# EAGLE design stm32f4-discovery-breakout-v2 (EAGLE 6.6.0)
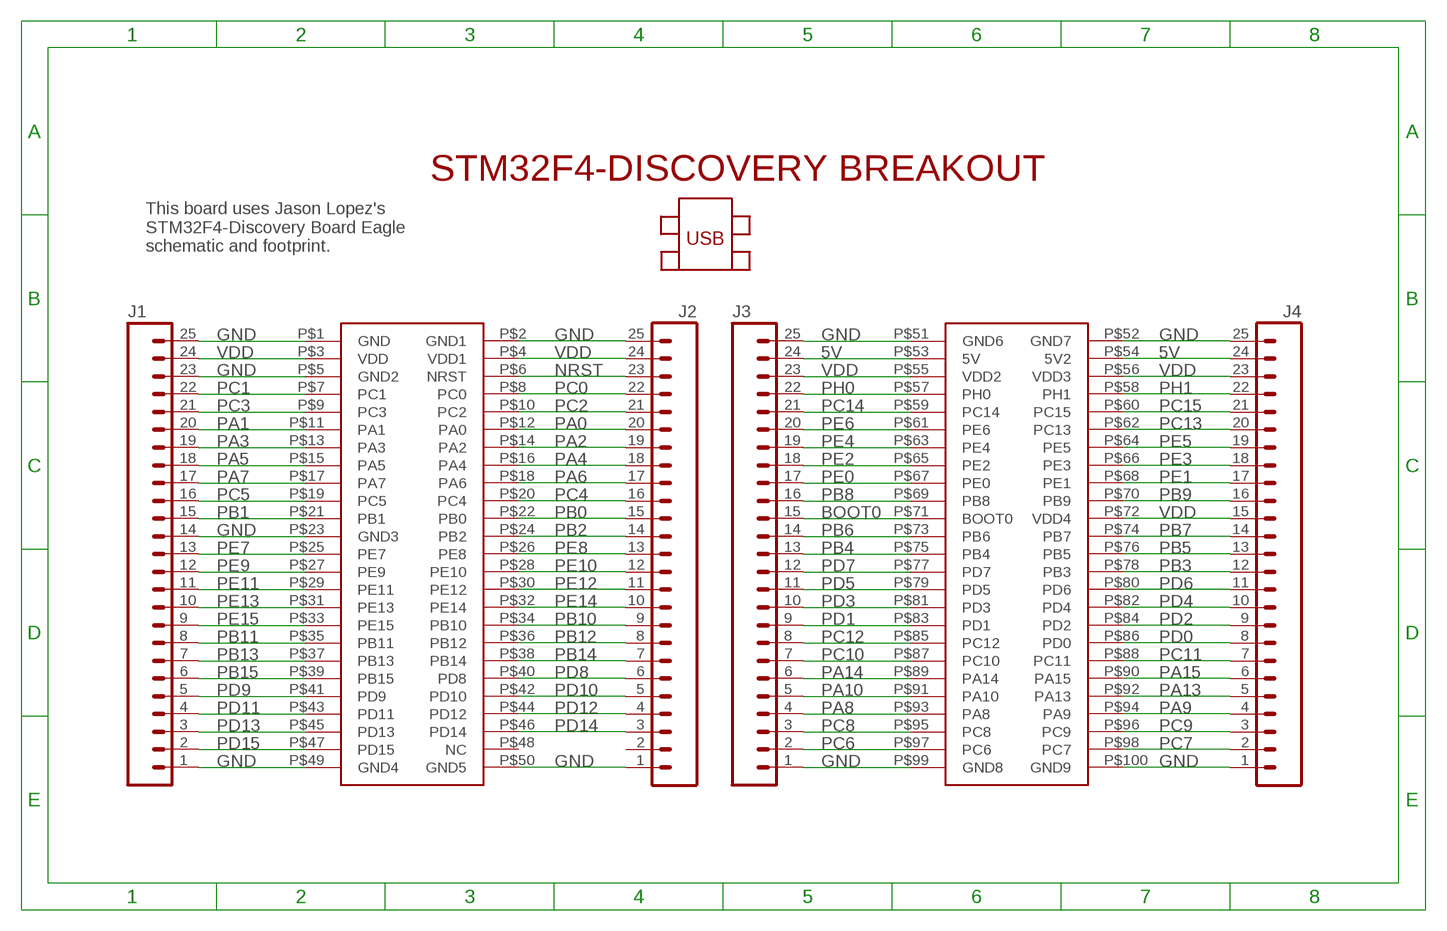
[diagram p0: schematic, sheet 1]

## Parts
J1  M25LOCK_LONGPADS  [1X25_LOCK_LONGPADS]
J2  M25LOCK_LONGPADS  [1X25_LOCK_LONGPADS]
J3  M25LOCK_LONGPADS  [1X25_LOCK_LONGPADS]
J4  M25LOCK_LONGPADS  [1X25_LOCK_LONGPADS]
U$1  STM32F4-DISCOVERY  [STM32F4-DISCOVERY]

## Nets
5V: J3.24 J4.24 U$1.P$53(5V) U$1.P$54(5V2)
BOOT0: J3.15 U$1.P$71(BOOT0)
GND: J1.1 J1.14 J1.23 J1.25 J2.1 J2.25 J3.1 J3.25 J4.1 J4.25 U$1.P$1(GND) U$1.P$2(GND1) U$1.P$5(GND2) U$1.P$23(GND3) U$1.P$49(GND4) U$1.P$50(GND5) U$1.P$51(GND6) U$1.P$52(GND7) U$1.P$99(GND8) U$1.P$100(GND9)
NRST: J2.23 U$1.P$6(NRST)
PA0: J2.20 U$1.P$12(PA0)
PA1: J1.20 U$1.P$11(PA1)
PA2: J2.19 U$1.P$14(PA2)
PA3: J1.19 U$1.P$13(PA3)
PA4: J2.18 U$1.P$16(PA4)
PA5: J1.18 U$1.P$15(PA5)
PA6: J2.17 U$1.P$18(PA6)
PA7: J1.17 U$1.P$17(PA7)
PA8: J3.4 U$1.P$93(PA8)
PA9: J4.4 U$1.P$94(PA9)
PA10: J3.5 U$1.P$91(PA10)
PA13: J4.5 U$1.P$92(PA13)
PA14: J3.6 U$1.P$89(PA14)
PA15: J4.6 U$1.P$90(PA15)
PB0: J2.15 U$1.P$22(PB0)
PB1: J1.15 U$1.P$21(PB1)
PB2: J2.14 U$1.P$24(PB2)
PB3: J4.12 U$1.P$78(PB3)
PB4: J3.13 U$1.P$75(PB4)
PB5: J4.13 U$1.P$76(PB5)
PB6: J3.14 U$1.P$73(PB6)
PB7: J4.14 U$1.P$74(PB7)
PB8: J3.16 U$1.P$69(PB8)
PB9: J4.16 U$1.P$70(PB9)
PB10: J2.9 U$1.P$34(PB10)
PB11: J1.8 U$1.P$35(PB11)
PB12: J2.8 U$1.P$36(PB12)
PB13: J1.7 U$1.P$37(PB13)
PB14: J2.7 U$1.P$38(PB14)
PB15: J1.6 U$1.P$39(PB15)
PC0: J2.22 U$1.P$8(PC0)
PC1: J1.22 U$1.P$7(PC1)
PC2: J2.21 U$1.P$10(PC2)
PC3: J1.21 U$1.P$9(PC3)
PC4: J2.16 U$1.P$20(PC4)
PC5: J1.16 U$1.P$19(PC5)
PC6: J3.2 U$1.P$97(PC6)
PC7: J4.2 U$1.P$98(PC7)
PC8: J3.3 U$1.P$95(PC8)
PC9: J4.3 U$1.P$96(PC9)
PC10: J3.7 U$1.P$87(PC10)
PC11: J4.7 U$1.P$88(PC11)
PC12: J3.8 U$1.P$85(PC12)
PC13: J4.20 U$1.P$62(PC13)
PC14: J3.21 U$1.P$59(PC14)
PC15: J4.21 U$1.P$60(PC15)
PD0: J4.8 U$1.P$86(PD0)
PD1: J3.9 U$1.P$83(PD1)
PD2: J4.9 U$1.P$84(PD2)
PD3: J3.10 U$1.P$81(PD3)
PD4: J4.10 U$1.P$82(PD4)
PD5: J3.11 U$1.P$79(PD5)
PD6: J4.11 U$1.P$80(PD6)
PD7: J3.12 U$1.P$77(PD7)
PD8: J2.6 U$1.P$40(PD8)
PD9: J1.5 U$1.P$41(PD9)
PD10: J2.5 U$1.P$42(PD10)
PD11: J1.4 U$1.P$43(PD11)
PD12: J2.4 U$1.P$44(PD12)
PD13: J1.3 U$1.P$45(PD13)
PD14: J2.3 U$1.P$46(PD14)
PD15: J1.2 U$1.P$47(PD15)
PE0: J3.17 U$1.P$67(PE0)
PE1: J4.17 U$1.P$68(PE1)
PE2: J3.18 U$1.P$65(PE2)
PE3: J4.18 U$1.P$66(PE3)
PE4: J3.19 U$1.P$63(PE4)
PE5: J4.19 U$1.P$64(PE5)
PE6: J3.20 U$1.P$61(PE6)
PE7: J1.13 U$1.P$25(PE7)
PE8: J2.13 U$1.P$26(PE8)
PE9: J1.12 U$1.P$27(PE9)
PE10: J2.12 U$1.P$28(PE10)
PE11: J1.11 U$1.P$29(PE11)
PE12: J2.11 U$1.P$30(PE12)
PE13: J1.10 U$1.P$31(PE13)
PE14: J2.10 U$1.P$32(PE14)
PE15: J1.9 U$1.P$33(PE15)
PH0: J3.22 U$1.P$57(PH0)
PH1: J4.22 U$1.P$58(PH1)
VDD: J1.24 J2.24 J3.23 J4.15 J4.23 U$1.P$3(VDD) U$1.P$4(VDD1) U$1.P$55(VDD2) U$1.P$56(VDD3) U$1.P$72(VDD4)
Unconnected: J2.2 U$1.P$48(NC)

## Notes on the sheet
- This board uses Jason Lopez's
  STM32F4-Discovery Board Eagle 
  schematic and footprint.

## Library data of the parts
J1-J4 = SparkFun-Connectors:M25: 1x25 .1" header
U$1 = STM32F4-DISCOVERY:STM32F4-DISCOVERY

## Board
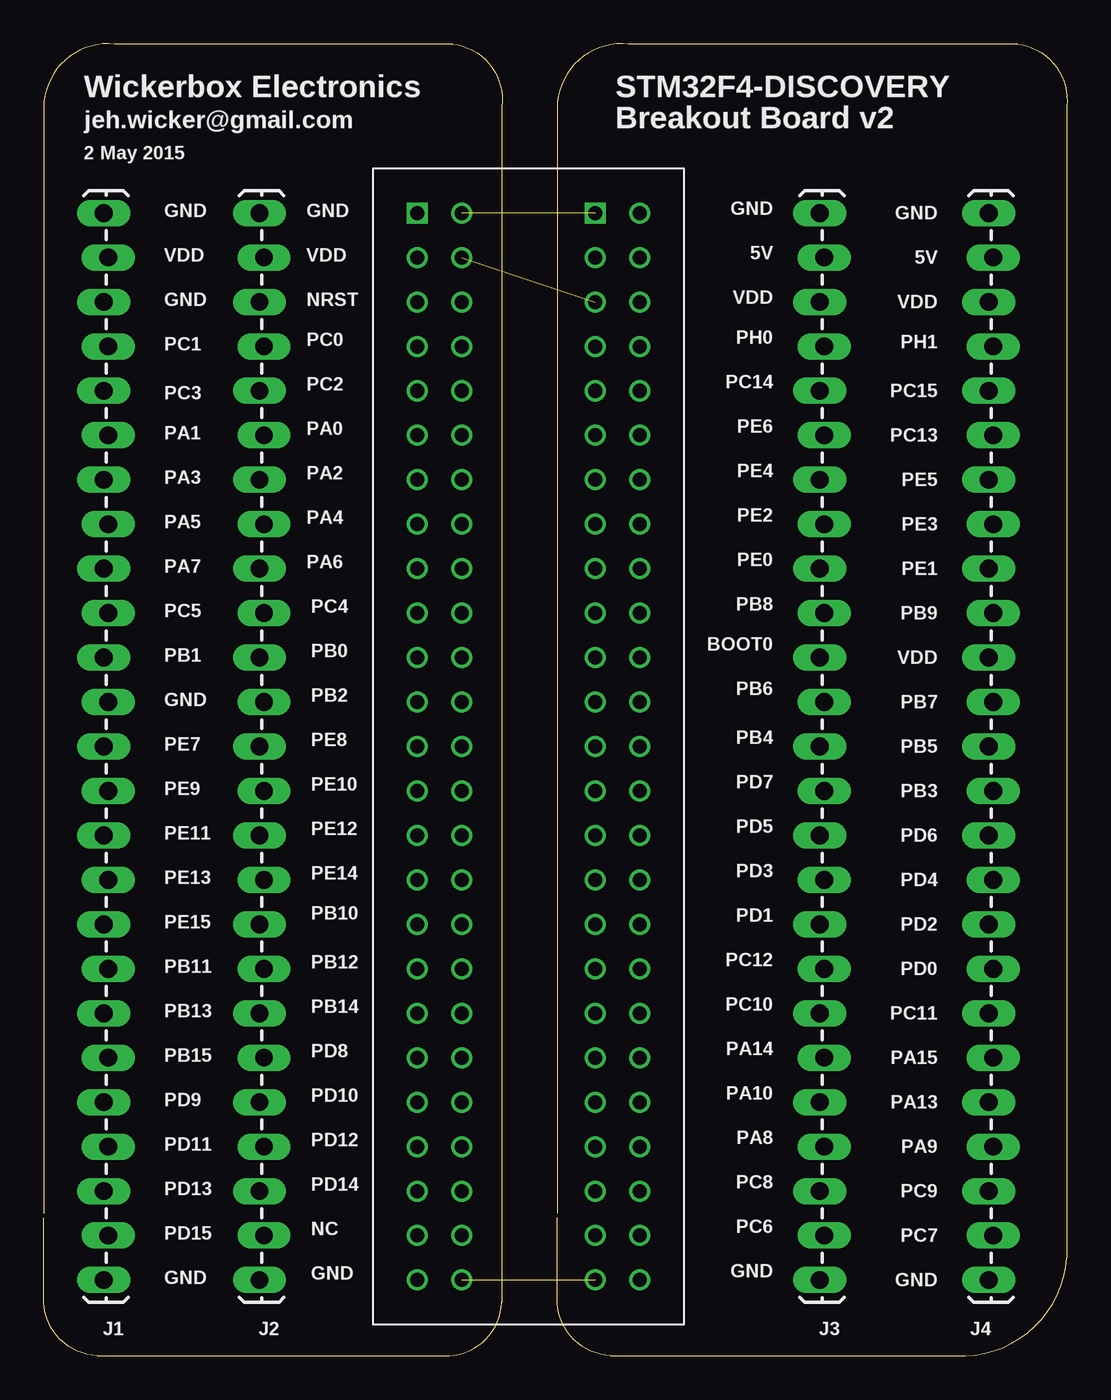
[diagram p1: board, top side]
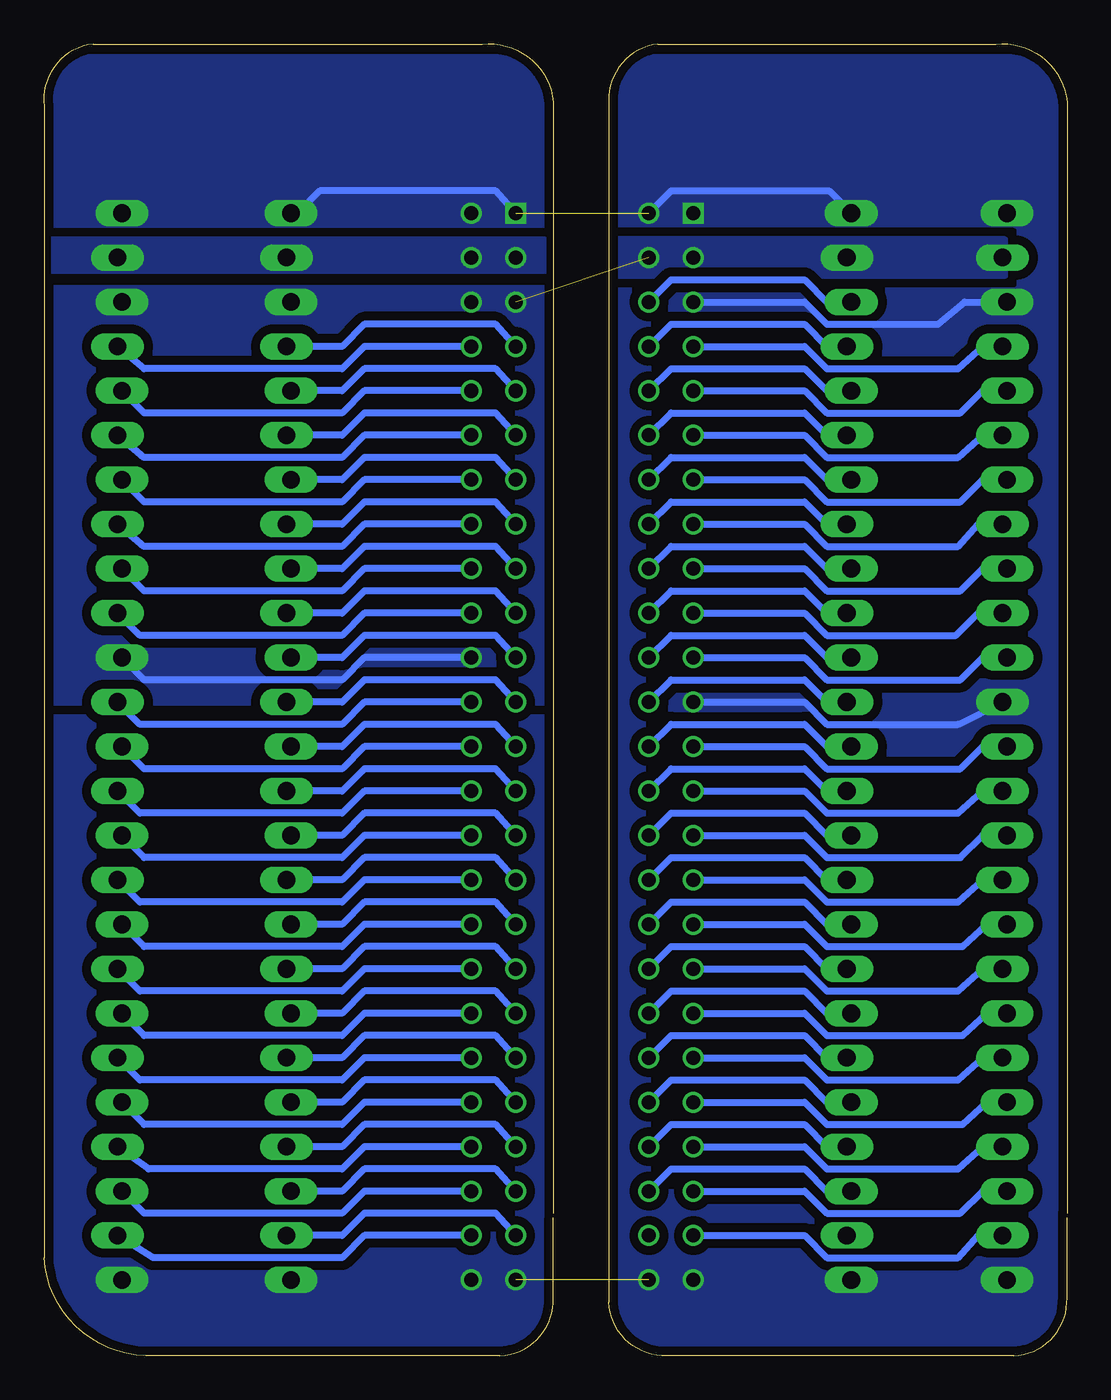
[diagram p2: board, bottom side, seen from below]

Size 58.44 x 74.96 mm. Coordinates in mm from the lower left corner, seen from the top.
Outline: 0,8.14 0,71.64 arc-90 4.06,74.94 23.37,74.94 arc-90 26.16,71.38 26.16,3.06 arc-90 22.86,0.01 3.05,0.01 arc-90 0,3.31 0,7.88
Outline: 29.34,8.14 29.34,71.64 arc-90 33.4,74.94 55.63,74.94 arc-90 58.42,71.38 58.42,5.6 arc-90 52.07,0.01 32.38,0.01 arc-90 29.34,3.31 29.34,7.88
Copper layers (1*16): Top 0.0356mm / dielectric 1.5011mm / Bottom 0.0356mm
Design rules "LaenPCBOrder": minimum track width 6mil, minimum drill 13mil, track to track 6mil, track to pad 6mil, pad to pad 6mil, via to via 6mil, smd to smd 6mil, copper to edge 15mil, drill to drill 6mil, minimum pad ring 7mil, minimum via ring 7mil, stop-mask expansion 3mil, vias tented up to drill 0mil, thermal gap 10mil

### Footprints (pad centres in the part's own frame; a part is rotated, then mirrored left to right if it is on the bottom)
1X25_LOCK_LONGPADS = drill 1.016 long: 1 0,0.127; 2 2.54,-0.127; 3 5.08,0.127; 4 7.62,-0.127; 5 10.16,0.127; 6 12.7,-0.127; 7 15.24,0.127; 8 17.78,-0.127; 9 20.32,0.127; 10 22.86,-0.127; 11 25.4,0.127; 12 27.94,-0.127; 13 30.48,0.127; 14 33.02,-0.127; 15 35.56,0.127; 16 38.1,-0.127; 17 40.64,0.127; 18 43.18,-0.127; 19 45.72,0.127; 20 48.26,-0.127; 21 50.8,0.127; 22 53.34,-0.127; 23 55.88,0.127; 24 58.42,-0.127; 25 60.96,0.127
STM32F4-DISCOVERY = drill 0.8 square: P$1 -27.94,30.48; P$51 -17.78,30.48 | drill 0.8: P$2 -25.4,30.48; P$3 -27.94,27.94; P$4 -25.4,27.94; P$5 -27.94,25.4; P$6 -25.4,25.4; P$7 -27.94,22.86; P$8 -25.4,22.86; P$9 -27.94,20.32; P$10 -25.4,20.32; P$11 -27.94,17.78; P$12 -25.4,17.78; P$13 -27.94,15.24; P$14 -25.4,15.24; P$15 -27.94,12.7; P$16 -25.4,12.7; P$17 -27.94,10.16; P$18 -25.4,10.16; P$19 -27.94,7.62; P$20 -25.4,7.62; P$21 -27.94,5.08; P$22 -25.4,5.08; P$23 -27.94,2.54; P$24 -25.4,2.54; P$25 -27.94,0; P$26 -25.4,0; P$27 -27.94,-2.54; P$28 -25.4,-2.54; P$29 -27.94,-5.08; P$30 -25.4,-5.08; P$31 -27.94,-7.62; P$32 -25.4,-7.62; P$33 -27.94,-10.16; P$34 -25.4,-10.16; P$35 -27.94,-12.7; P$36 -25.4,-12.7; P$37 -27.94,-15.24; P$38 -25.4,-15.24; P$39 -27.94,-17.78; P$40 -25.4,-17.78; P$41 -27.94,-20.32; P$42 -25.4,-20.32; P$43 -27.94,-22.86; P$44 -25.4,-22.86; P$45 -27.94,-25.4; P$46 -25.4,-25.4; P$47 -27.94,-27.94; P$48 -25.4,-27.94; P$49 -27.94,-30.48; P$50 -25.4,-30.48; P$52 -15.24,30.48; P$53 -17.78,27.94; P$54 -15.24,27.94; P$55 -17.78,25.4; P$56 -15.24,25.4; P$57 -17.78,22.86; P$58 -15.24,22.86; P$59 -17.78,20.32; P$60 -15.24,20.32; P$61 -17.78,17.78; P$62 -15.24,17.78; P$63 -17.78,15.24; P$64 -15.24,15.24; P$65 -17.78,12.7; P$66 -15.24,12.7; P$67 -17.78,10.16; P$68 -15.24,10.16; P$69 -17.78,7.62; P$70 -15.24,7.62; P$71 -17.78,5.08; P$72 -15.24,5.08; P$73 -17.78,2.54; P$74 -15.24,2.54; P$75 -17.78,0; P$76 -15.24,0; P$77 -17.78,-2.54; P$78 -15.24,-2.54; P$79 -17.78,-5.08; P$80 -15.24,-5.08; P$81 -17.78,-7.62; P$82 -15.24,-7.62; P$83 -17.78,-10.16; P$84 -15.24,-10.16; P$85 -17.78,-12.7; P$86 -15.24,-12.7; P$87 -17.78,-15.24; P$88 -15.24,-15.24; P$89 -17.78,-17.78; P$90 -15.24,-17.78; P$91 -17.78,-20.32; P$92 -15.24,-20.32; P$93 -17.78,-22.86; P$94 -15.24,-22.86; P$95 -17.78,-25.4; P$96 -15.24,-25.4; P$97 -17.78,-27.94; P$98 -15.24,-27.94; P$99 -17.78,-30.48; P$100 -15.24,-30.48

### Placement (x,y rotation side)
J1  3.56,4.33 90 top
J2  12.45,4.33 90 top
J3  44.45,4.33 90 top
J4  54.1,4.33 90 top
U$1  49.28,34.81 0 top

### Tracks (layer width: path | path; a pad name or v marks a point on that pad's centre or on a via)
5V
  pour Bottom (rank 2, no thermals): 29.84,63.76 29.84,61.99 59.69,61.99 59.69,63.76
BOOT0
  Bottom 0.406: U$1.P$71 32.64,41.16 40.13,41.16 41.4,39.89 J3.15
GND  (2 unrouted)
  Bottom 0.406: U$1.P$2 22.61,66.56 13.59,66.56 J2.25 | U$1.P$23 14.99,37.35 13.72,36.08 6.22,36.08 J1.14 | U$1.P$51 32.64,66.56 42.67,66.56 43.94,65.29 J3.25 | U$1.P$5 14.99,60.21 13.72,58.94 7.37,58.94 5.84,60.21 J1.23
  pour Bottom (isolate 0.508, rank 3, no thermals): -0.25,74.18 -0.25,0.52 60.45,0.52 60.45,74.18
NRST
  Bottom 0.406: U$1.P$6 22.61,61.48 14.99,61.48 13.72,60.21 J2.23
PA0
  Bottom 0.406: U$1.P$12 22.61,53.86 14.99,53.86 13.72,52.59 J2.20 12.45,52.59
PA1
  Bottom 0.406: U$1.P$11 14.99,52.59 13.72,51.32 6.22,51.32 5.08,52.33 4.83,52.59 J1.20
PA2
  Bottom 0.406: U$1.P$14 22.61,51.32 14.99,51.32 13.72,50.05 J2.19
PA3
  Bottom 0.406: U$1.P$13 14.99,50.05 13.72,48.78 6.1,48.78 4.83,50.05 J1.19
PA4
  Bottom 0.406: U$1.P$16 22.61,48.78 14.99,48.78 13.72,47.51 J2.18 12.45,47.51
PA5
  Bottom 0.406: U$1.P$15 14.99,47.51 13.72,46.24 6.22,46.24 5.08,47.51 J1.18
PA6
  Bottom 0.406: U$1.P$18 22.61,46.24 14.99,46.24 13.72,44.97 J2.17
PA7
  Bottom 0.406: U$1.P$17 14.99,44.97 13.72,43.7 6.1,43.7 4.83,44.97 J1.17
PA8
  Bottom 0.406: U$1.P$93 32.64,13.22 40.13,13.22 41.4,11.95 J3.4
PA9
  Bottom 0.406: U$1.P$94 40.13,11.95 41.4,10.68 52.45,10.68 J4.4
PA10
  Bottom 0.406: U$1.P$91 32.64,15.76 40.13,15.76 41.4,14.49 J3.5
PA13
  Bottom 0.406: U$1.P$92 40.13,14.49 41.4,13.22 52.7,13.22 J4.5
PA14
  Bottom 0.406: U$1.P$89 32.64,18.3 40.13,18.3 41.4,17.03 J3.6
PA15
  Bottom 0.406: U$1.P$90 40.13,17.03 41.4,15.76 52.96,15.76 J4.6
PB0
  Bottom 0.406: U$1.P$22 22.61,41.16 14.99,41.16 13.72,39.89 J2.15
PB1
  Bottom 0.406: U$1.P$21 14.99,39.89 13.72,38.62 6.1,38.62 4.83,39.89 J1.15
PB2
  Bottom 0.406: U$1.P$24 22.61,38.62 14.99,38.62 13.72,37.35 J2.14
PB3
  Bottom 0.406: U$1.P$78 40.13,32.27 41.4,31 52.96,31 J4.12
PB4
  Bottom 0.406: U$1.P$75 32.64,36.08 40.13,36.08 41.4,34.81 J3.13
PB5
  Bottom 0.406: U$1.P$76 40.13,34.81 41.4,33.54 52.7,33.54 J4.13
PB6
  Bottom 0.406: U$1.P$73 32.64,38.62 40.13,38.62 41.4,37.35 J3.14
PB7
  Bottom 0.406: U$1.P$74 40.13,37.35 41.4,36.08 52.96,36.08 J4.14
PB8
  Bottom 0.406: U$1.P$69 32.64,43.7 40.13,43.7 41.4,42.43 J3.16
PB9
  Bottom 0.406: U$1.P$70 40.13,42.43 41.4,41.16 52.96,41.16 J4.16
PB10
  Bottom 0.406: U$1.P$34 22.61,25.92 14.99,25.92 13.72,24.65 J2.9
PB11
  Bottom 0.406: U$1.P$35 14.99,22.11 13.72,20.84 6.22,20.84 4.83,22.11 J1.8
PB12
  Bottom 0.406: U$1.P$36 22.61,23.38 14.99,23.38 13.72,22.11 J2.8
PB13
  Bottom 0.406: U$1.P$37 14.99,19.57 13.72,18.3 5.97,18.3 4.57,19.57 J1.7
PB14
  Bottom 0.406: U$1.P$38 22.61,20.84 14.99,20.84 13.72,19.57 J2.7
PB15
  Bottom 0.406: U$1.P$39 14.99,17.03 13.72,15.76 6.22,15.76 4.83,17.03 J1.6
PC0
  Bottom 0.406: U$1.P$8 22.61,58.94 14.99,58.94 13.72,57.67 J2.22
PC1
  Bottom 0.406: U$1.P$7 14.99,57.67 13.72,56.4 6.22,56.4 5.08,57.41 4.83,57.67 J1.22
PC2
  Bottom 0.406: U$1.P$10 22.61,56.4 14.99,56.4 13.72,55.13 J2.21
PC3
  Bottom 0.406: U$1.P$9 14.99,55.13 13.72,53.86 6.1,53.86 4.83,55.13 J1.21
PC4
  Bottom 0.406: U$1.P$20 22.61,43.7 14.99,43.7 13.72,42.43 J2.16
PC5
  Bottom 0.406: U$1.P$19 14.99,42.43 13.72,41.16 6.35,41.16 5.08,42.43 J1.16
PC6
  Bottom 0.406: U$1.P$97 32.64,8.14 40.13,8.14 41.4,6.87 J3.2
PC7
  Bottom 0.406: U$1.P$98 40.13,6.87 41.4,5.6 52.2,5.6 J4.2
PC8
  Bottom 0.406: U$1.P$95 32.64,10.68 40.13,10.68 41.4,9.41 J3.3
PC9
  Bottom 0.406: U$1.P$96 40.13,9.41 41.4,8.14 52.7,8.14 J4.3
PC10
  Bottom 0.406: U$1.P$87 32.64,20.84 40.13,20.84 41.4,19.57 J3.7 45.21,19.57
PC11
  Bottom 0.406: U$1.P$88 40.13,19.57 41.4,18.3 52.7,18.3 J4.7
PC12
  Bottom 0.406: U$1.P$85 32.64,23.38 40.13,23.38 41.4,22.11 J3.8
PC13
  Bottom 0.406: U$1.P$62 40.13,52.59 41.4,51.32 52.7,51.32 J4.20
PC14
  Bottom 0.406: U$1.P$59 32.64,56.4 40.13,56.4 41.4,55.13 J3.21
PC15
  Bottom 0.406: U$1.P$60 40.13,55.13 41.4,53.86 52.7,53.86 J4.21
PD0
  Bottom 0.406: U$1.P$86 40.13,22.11 41.4,20.84 52.96,20.84 J4.8
PD1
  Bottom 0.406: U$1.P$83 32.64,25.92 40.13,25.92 41.4,24.65 J3.9
PD2
  Bottom 0.406: U$1.P$84 40.13,24.65 41.4,23.38 52.7,23.38 J4.9
PD3
  Bottom 0.406: U$1.P$81 32.64,28.46 40.13,28.46 41.4,27.19 J3.10
PD4
  Bottom 0.406: U$1.P$82 40.13,27.19 41.4,25.92 52.96,25.92 J4.10
PD5
  Bottom 0.406: U$1.P$79 32.64,31 40.13,31 41.4,29.73 J3.11
PD6
  Bottom 0.406: U$1.P$80 40.13,29.73 41.4,28.46 52.7,28.46 J4.11
PD7
  Bottom 0.406: U$1.P$77 32.64,33.54 40.13,33.54 41.4,32.27 J3.12
PD8
  Bottom 0.406: U$1.P$40 22.61,18.3 14.99,18.3 13.72,17.03 J2.6
PD9
  Bottom 0.406: U$1.P$41 14.99,14.49 13.72,13.22 5.97,13.22 4.57,14.49 J1.5
PD10
  Bottom 0.406: U$1.P$42 22.61,15.76 14.99,15.76 13.72,14.49 J2.5
PD11
  Bottom 0.406: U$1.P$43 14.99,11.95 13.72,10.68 6.22,10.68 4.83,11.95 J1.4
PD12
  Bottom 0.406: U$1.P$44 22.61,13.22 14.99,13.22 13.72,11.95 J2.4
PD13
  Bottom 0.406: U$1.P$45 14.99,9.41 13.72,8.14 6.1,8.14 4.83,9.41 J1.3
PD14
  Bottom 0.406: U$1.P$46 22.61,10.68 14.99,10.68 13.72,9.41 J2.3
PD15
  Bottom 0.406: U$1.P$47 14.99,6.87 13.72,5.6 6.22,5.6 5.08,6.87 J1.2
PE0
  Bottom 0.406: U$1.P$67 32.64,46.24 40.13,46.24 41.4,44.97 J3.17
PE1
  Bottom 0.406: U$1.P$68 40.13,44.97 41.4,43.7 52.7,43.7 J4.17
PE2
  Bottom 0.406: U$1.P$65 32.64,48.78 40.13,48.78 41.4,47.51 J3.18
PE3
  Bottom 0.406: U$1.P$66 40.13,47.51 41.4,46.24 52.7,46.24 J4.18
PE4
  Bottom 0.406: U$1.P$63 32.64,51.32 40.13,51.32 41.4,50.05 J3.19
PE5
  Bottom 0.406: U$1.P$64 40.13,50.05 41.4,48.78 52.7,48.78 J4.19
PE6
  Bottom 0.406: U$1.P$61 32.64,53.86 40.13,53.86 41.4,52.59 J3.20
PE7
  Bottom 0.406: U$1.P$25 14.99,34.81 13.72,33.54 6.1,33.54 4.83,34.81 J1.13
PE8
  Bottom 0.406: U$1.P$26 22.61,36.08 14.99,36.08 13.72,34.81 J2.13
PE9
  Bottom 0.406: U$1.P$27 14.99,32.27 13.72,31 6.22,31 4.83,32.27 J1.12
PE10
  Bottom 0.406: U$1.P$28 22.61,33.54 14.99,33.54 13.72,32.27 J2.12
PE11
  Bottom 0.406: U$1.P$29 14.99,29.73 13.72,28.46 6.1,28.46 4.83,29.73 J1.11
PE12
  Bottom 0.406: U$1.P$30 22.61,31 14.99,31 13.72,29.73 J2.11
PE13
  Bottom 0.406: U$1.P$31 14.99,27.19 13.72,25.92 6.22,25.92 4.83,27.19 J1.10
PE14
  Bottom 0.406: U$1.P$32 22.61,28.46 14.99,28.46 13.72,27.19 J2.10
PE15
  Bottom 0.406: U$1.P$33 14.99,24.65 13.72,23.38 5.97,23.38 4.57,24.65 J1.9
PH0
  Bottom 0.406: U$1.P$57 32.64,58.94 40.13,58.94 41.4,57.67 J3.22
PH1
  Bottom 0.406: U$1.P$58 40.13,57.67 41.4,56.4 52.7,56.4 J4.22
VDD  (1 unrouted)
  Bottom 0.406: U$1.P$72 40.13,39.89 41.4,38.62 52.7,38.62 J4.15
  pour Bottom (isolate 0.508, no thermals): 29.34,60.97 59.69,60.97 59.69,37.35 28.19,37.35 28.19,61.73 3.56,61.73 3.56,63.76 29.34,63.76

### Text on the board
tPlace: Wickerbox Electronics | STM32F4-DISCOVERY | jeh.wicker@gmail.com | Breakout Board v2 | 2 May 2015
tNames: GND | GND | GND | GND | 5V | 5V | VDD | VDD | GND | NRST | VDD | VDD | PC0 | PH0 | PH1 | PC1 | PC14 | PC3 | PC2 | PC15 | PA0 | PE6 | PC13 | PA1 | PE4 | PA3 | PA2 | PE5 | PE2 | PA5 | PA4 | PE3 | PA7 | PA6 | PE0 | PE1 | PB8 | PC5 | PC4 | PB9 | BOOT0 | PB1 | PB0 | VDD | PB6 | GND | PB2 | PB7 | PE7 | PE8 | PB4 | PB5 | PD7 | PE9 | PE10 | PB3 | PE12 | PD5 | PD6 | PE11 | PD3 | PE13 | PE14 | PD4 | PB10 | PD1 | PD2 | PE15 | PC12 | PB11 | PB12 | PD0 | PB14 | PC10 | PC11 | PB13 | PA14 | PB15 | PD8 | PA15 | PA10 | PD9 | PD10 | PA13 | PD11 | PD12 | PA8 | PA9 | PC8 | PD13 | PD14 | PC9 | PD15 | NC | PC6 | PC7 | GND | GND | GND | GND